# EAGLE design reg (EAGLE 9.6.2)
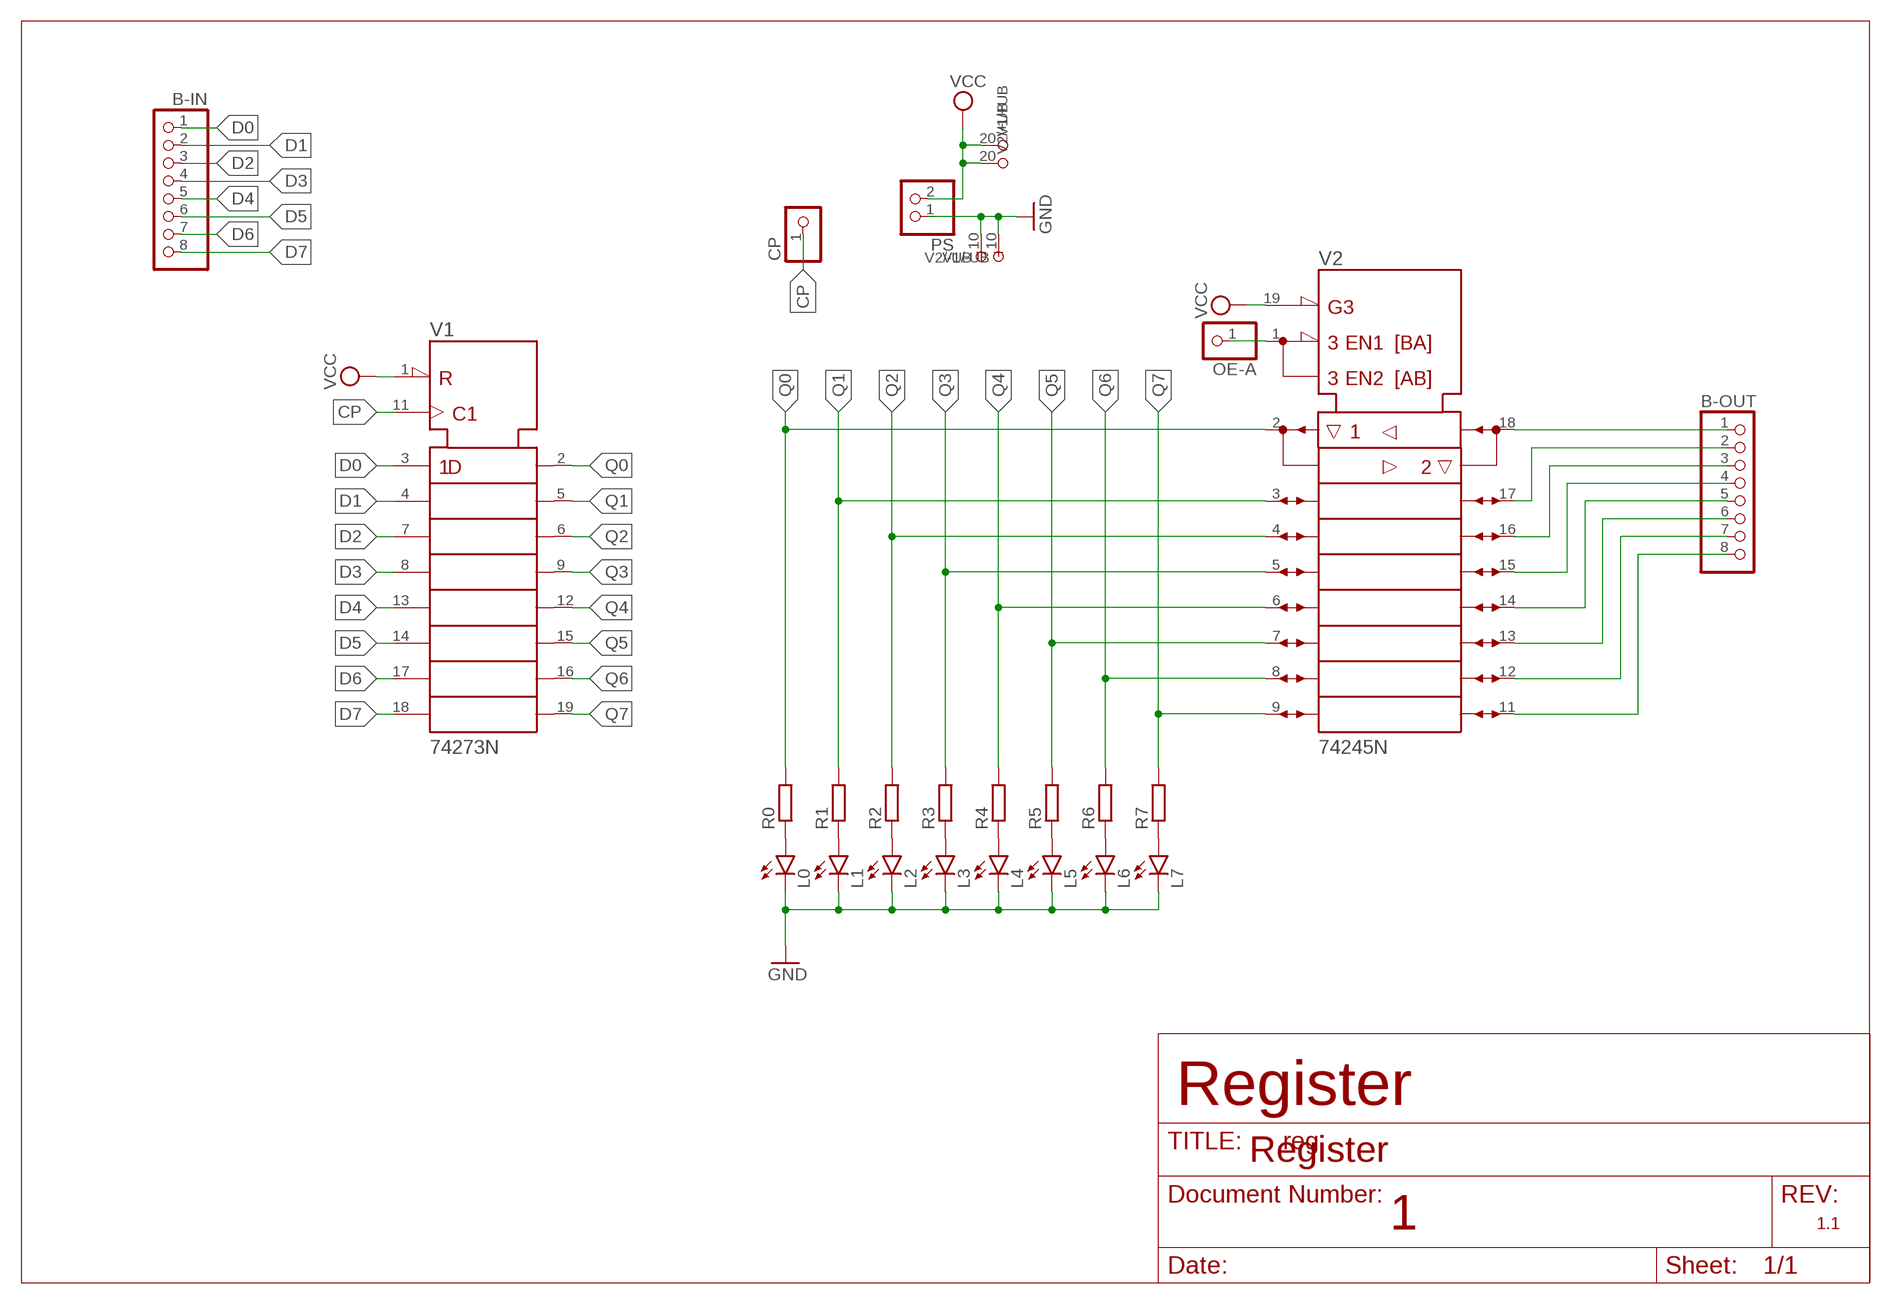
[diagram p0: schematic, sheet 1]

## Parts
B-IN  PINHD-1X8  [1X08]
B-OUT  PINHD-1X8  [1X08]
CP  PINHD-1X1  [1X01]
L0  LED5MM  [LED5MM]
L1  LED5MM  [LED5MM]
L2  LED5MM  [LED5MM]
L3  LED5MM  [LED5MM]
L4  LED5MM  [LED5MM]
L5  LED5MM  [LED5MM]
L6  LED5MM  [LED5MM]
L7  LED5MM  [LED5MM]
OE-A  PINHD-1X1  [1X01]
PS  PINHD-1X2  [1X02]
R0  R-EU_0204/7  [0204/7]
R1  R-EU_0204/7  [0204/7]
R2  R-EU_0204/7  [0204/7]
R3  R-EU_0204/7  [0204/7]
R4  R-EU_0204/7  [0204/7]
R5  R-EU_0204/7  [0204/7]
R6  R-EU_0204/7  [0204/7]
R7  R-EU_0204/7  [0204/7]
V1  74273N  [DIL20]
V2  74245N  [DIL20]

## Nets
BO0: B-OUT.8 V2.11(B8)
BO1: B-OUT.7 V2.12(B7)
BO2: B-OUT.6 V2.13(B6)
BO3: B-OUT.5 V2.14(B5)
BO4: B-OUT.4 V2.15(B4)
BO5: B-OUT.3 V2.16(B3)
BO6: B-OUT.2 V2.17(B2)
BO7: B-OUT.1 V2.18(B1)
CP: CP.1 V1.11(CLK)
D0: B-IN.1 V1.3(1D)
D1: B-IN.2 V1.4(2D)
D2: B-IN.3 V1.7(3D)
D3: B-IN.4 V1.8(4D)
D4: B-IN.5 V1.13(5D)
D5: B-IN.6 V1.14(6D)
D6: B-IN.7 V1.17(7D)
D7: B-IN.8 V1.18(8D)
GND: L0.K(C) L1.K(C) L2.K(C) L3.K(C) L4.K(C) L5.K(C) L6.K(C) L7.K(C) PS.1 V1.10(-UB) V2.10(-UB)
N$1: L7.A R7.1
N$5: L6.A R6.1
N$6: L5.A R5.1
N$7: L4.A R4.1
N$8: L3.A R3.1
N$9: L2.A R2.1
N$10: L1.A R1.1
N$11: L0.A R0.1
N$19: OE-A.1 V2.1(DIR)
Q0: R0.2 V1.2(1Q) V2.2(A1)
Q1: R1.2 V1.5(2Q) V2.3(A2)
Q2: R2.2 V1.6(3Q) V2.4(A3)
Q3: R3.2 V1.9(4Q) V2.5(A4)
Q4: R4.2 V1.12(5Q) V2.6(A5)
Q5: R5.2 V1.15(6Q) V2.7(A6)
Q6: R6.2 V1.16(7Q) V2.8(A7)
Q7: R7.2 V1.19(8Q) V2.9(A8)
VCC: PS.2 V1.1(!CLR) V1.20(+UB) V2.19(!G) V2.20(+UB)

## Notes on the sheet
- Register
- Register
- 1 | 1.1

## Library data of the parts
B-IN B-OUT = pinhead:PINHD-1X8: PIN HEADER
CP OE-A = pinhead:PINHD-1X1: PIN HEADER
L0 L1-L7 = led:LED: LED OSRAM: - CHIPLED LG R971, LG N971, LY N971, LG Q971, LY Q971, LO R971, LY R971 LH N974, LH R974 LS Q976, LO Q976, LY Q976 LO Q996 - Hyper CHIPLED LW Q18S LB Q993, LB Q99A, LB R99A - SideLED LS A670, LO A670, LY A670, LG A670, LP A670 LB A673, LV A673, LT A673, LW A673 LH A674 LY A675 LS A676, LA A676, LO A676, LY A676, LW A676 LS A679, LY A679, LG A679 - Hyper Micro SIDELED® LS Y876, LA Y876, LO Y876, LY Y876 LT Y87S - SmartLED LW L88C, LW L88S LB L89C, LB L89S, LG L890 LS L89K, LO L89K, LY L89K LS L896, LA L896, LO L896, LY L896 - TOPLED LS T670, LO T670, LY T670, LG T670, LP T670 LSG T670, LSP T670, LSY T670, LOP T670, LYG T670 LG T671, LOG T671, LSG T671 LB T673, LV T673, LT T673, LW T673 LH T674 LS T676, LA T676, LO T676, LY T676, LB T676, LH T676, LSB T676, LW T676 LB T67C, LV T67C, LT T67C, LS T67K, LO T67K, LY T67K, LW E67C LS E67B, LA E67B, LO E67B, LY E67B, LB E67C, LV E67C, LT E67C LW T67C LS T679, LY T679, LG T679 LS T770, LO T770, LY T770, LG T770, LP T770 LB T773, LV T773, LT T773, LW T773 LH T774 LS E675, LA E675, LY E675, LS T675 LS T776, LA T776, LO T776, LY T776, LB T776 LHGB T686 LT T68C, LB T68C - Hyper Mini TOPLED® LB M676 - Mini TOPLED Santana® LG M470 LS M47K, LO M47K, LY M47K Source: http://www.osram.convergy.de LUXEON: - LUMILED® LXK2-PW12-R00, LXK2-PW12-S00, LXK2-PW14-U00, LXK2-PW14-V00 LXK2-PM12-R00, LXK2-PM12-S00, LXK2-PM14-U00 LXK2-PE12-Q00, LXK2-PE12-R00, LXK2-PE12-S00, LXK2-PE14-T00, LXK2-PE14-U00 LXK2-PB12-K00, LXK2-PB12-L00, LXK2-PB12-M00, LXK2-PB14-N00, LXK2-PB14-P00, LXK2-PB14-Q00 LXK2-PR12-L00, LXK2-PR12-M00, LXK2-PR14-Q00, LXK2-PR14-R00 LXK2-PD12-Q00, LXK2-PD12-R00, LXK2-PD12-S00 LXK2-PH12-R00, LXK2-PH12-S00 LXK2-PL12-P00, LXK2-PL12-Q00, LXK2-PL12-R00 Source: www.luxeon.com KINGBRIGHT: KA-3528ASYC Source: www.kingbright.com
PS = pinhead:PINHD-1X2: PIN HEADER
R0 R1-R7 = rcl:R-EU_: RESISTOR, European symbol; SPICEPREFIX: R
V1 = 74ttl-din:74*273: Octal D type FLIP FLOP, clear
V2 = 74ttl-din:74*245: Octal BUS TRANSCEIVER, 3-state

## Board
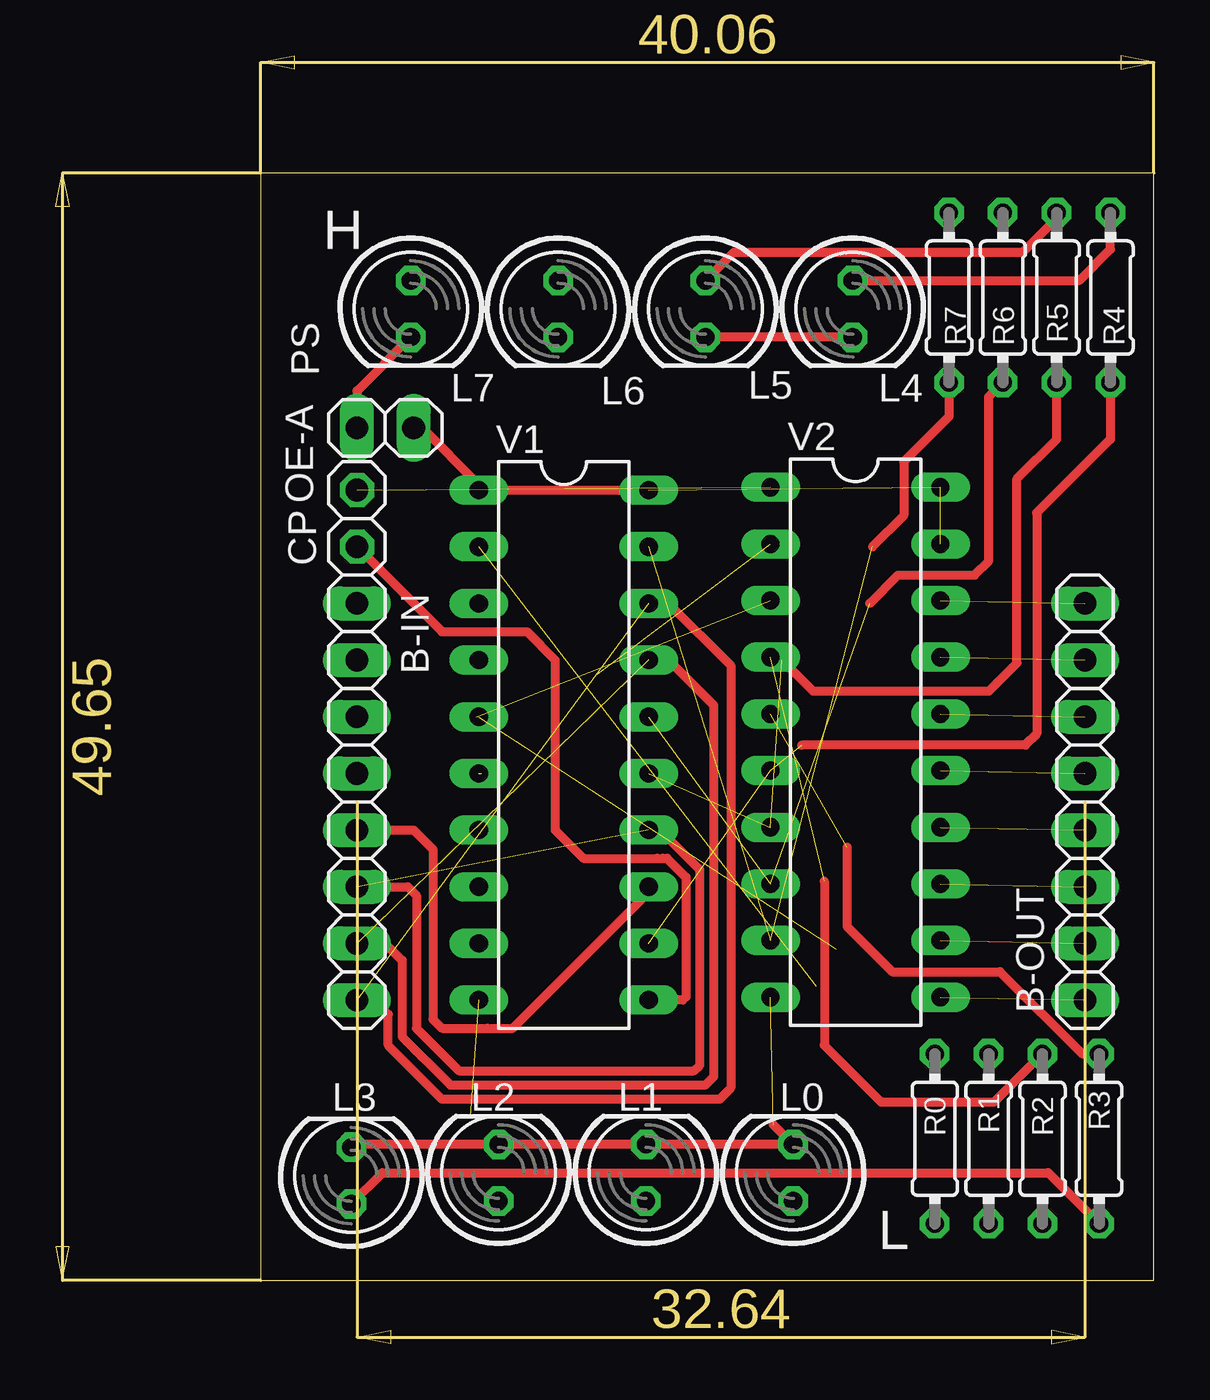
[diagram p1: board, top side]
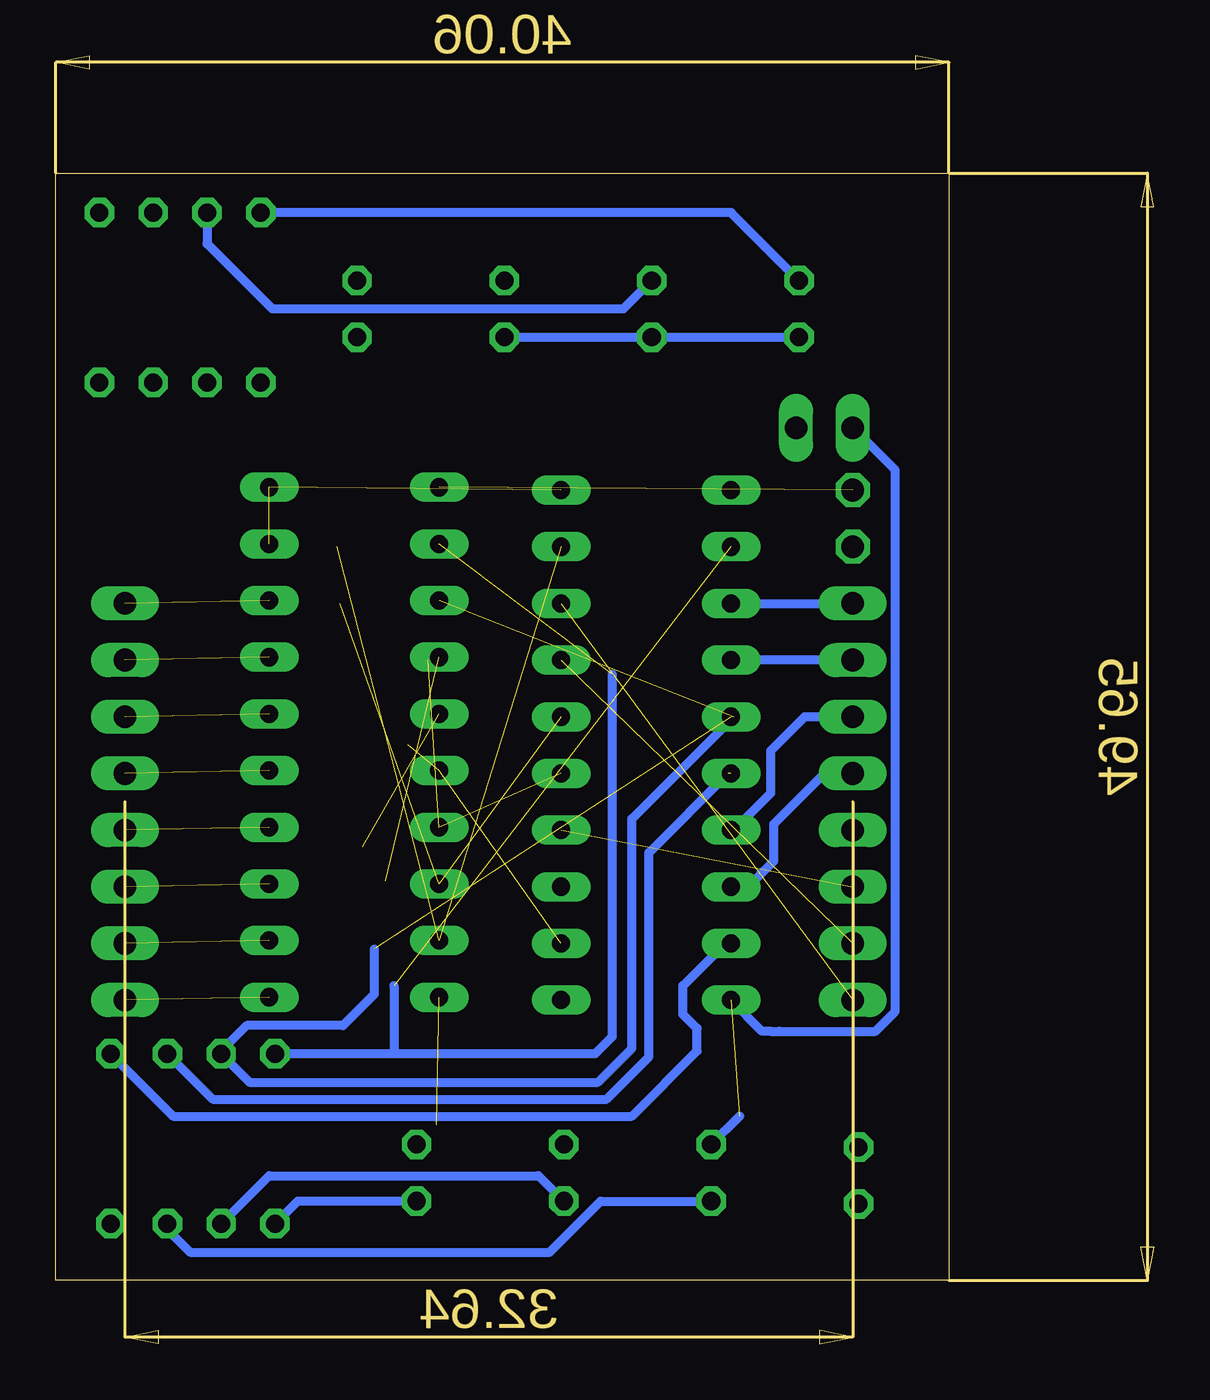
[diagram p2: board, bottom side, seen from below]

Size 40.06 x 49.65 mm. Coordinates in mm from the lower left corner, seen from the top.
Outline: 0,0 40.06,0 40.06,49.65 0,49.65 0,0
Copper layers (1*16): Top 0.035mm / dielectric 1.5mm / Bottom 0.035mm
Design rules "default": minimum track width 6mil, minimum drill 0.35mm, track to track 6mil, track to pad 6mil, pad to pad 6mil, via to via 6mil, smd to smd 6mil, copper to edge 40mil, drill to drill 6mil, minimum pad ring 10mil, minimum via ring 8mil, stop-mask expansion 4mil, vias tented up to drill 0mil, thermal gap 10mil

### Footprints (pad centres in the part's own frame; a part is rotated, then mirrored left to right if it is on the bottom)
1X08 = drill 1.016 long: 1 -8.89,0; 2 -6.35,0; 3 -3.81,0; 4 -1.27,0; 5 1.27,0; 6 3.81,0; 7 6.35,0; 8 8.89,0
1X01 = drill 1.016 octagon: 1 0,0
LED5MM = drill 0.813 octagon: A -1.27,0; K 1.27,0
1X02 = drill 1.016 long: 1 -1.27,0; 2 1.27,0
0204/7 = drill 0.813 octagon: 1 -3.81,0; 2 3.81,0
DIL20 = drill 0.813 long: 1 -11.43,-3.81; 2 -8.89,-3.81; 3 -6.35,-3.81; 4 -3.81,-3.81; 5 -1.27,-3.81; 6 1.27,-3.81; 7 3.81,-3.81; 8 6.35,-3.81; 9 8.89,-3.81; 10 11.43,-3.81; 11 11.43,3.81; 12 8.89,3.81; 13 6.35,3.81; 14 3.81,3.81; 15 1.27,3.81; 16 -1.27,3.81; 17 -3.81,3.81; 18 -6.35,3.81; 19 -8.89,3.81; 20 -11.43,3.81

### Placement (x,y rotation side)
B-IN  4.32,21.46 270 top
B-OUT  36.96,21.46 270 top
CP  4.32,32.89 0 top
L0  23.88,4.83 90 top
L1  17.27,4.83 90 top
L2  10.67,4.83 90 top
L3  4.06,4.7 90 top
L4  26.54,43.56 270 top
L5  19.94,43.56 270 top
L6  13.34,43.56 270 top
L7  6.73,43.56 270 top
OE-A  4.32,35.43 0 top
PS  5.59,38.23 0 top
R0  30.23,6.35 90 top
R1  32.64,6.35 90 top
R2  35.05,6.35 90 top
R3  37.59,6.35 90 top
R4  38.1,44.07 270 top
R5  35.69,44.07 270 top
R6  33.27,44.07 270 top
R7  30.86,44.07 270 top
V1  13.59,24 270 top
V2  26.67,24.13 270 top

### Tracks (layer width: path | path; a pad name or v marks a point on that pad's centre or on a via)
BO0  (1 unrouted)
BO1  (1 unrouted)
BO2  (1 unrouted)
BO3  (1 unrouted)
BO4  (1 unrouted)
BO5  (1 unrouted)
BO6  (1 unrouted)
BO7  (1 unrouted)
CP
  Top 0.4: CP.1 8.13,29.08 11.94,29.08 13.21,27.81 13.21,20.19 14.48,18.92 17.78,18.92 18.03,18.92 18.22,18.92 19.07,18.07 19.07,12.72 18.92,12.57 V1.11
D0
  Bottom 0.4: V1.3 B-IN.1
D1
  Bottom 0.4: B-IN.2 V1.4
D2
  Bottom 0.4: B-IN.3 6.48,25.27 8,23.75 8,21.84 9.65,20.19 V1.7
D3
  Bottom 0.4: B-IN.4 5.59,22.73 7.87,20.45 7.87,18.8 9.02,17.65 V1.8
D4
  Top 0.4: B-IN.5 6.86,20.19 7.72,19.33 7.72,11.71 8.13,11.3 10.16,11.3 10.67,11.3 11.3,11.3 17.4,17.4 V1.13
D5  (1 unrouted)
  Top 0.4: 17.91,20.19 19.68,18.41 19.68,9.65 19.43,9.4 8.89,9.4 6.99,11.3 6.99,17.27 6.6,17.65 B-IN.6
D6  (1 unrouted)
  Top 0.4: 18.29,27.81 20.32,25.78 20.32,9.14 19.94,8.76 8.51,8.76 6.35,10.92 6.35,14.35 5.59,15.11 B-IN.7
D7  (1 unrouted)
  Top 0.4: 18.29,30.35 21.08,27.56 21.08,8.64 20.57,8.13 8.13,8.13 5.71,10.54 5.71,11.94 5.08,12.57 B-IN.8
GND  (2 unrouted)
  Top 0.4: 22.99,6.99 L0.K L1.K L2.K 4.19,6.1 L3.K | L4.K L5.K | L7.K 4.32,39.88 PS.1
  Bottom 0.4: PS.1 2.41,36.32 2.41,12.06 3.3,11.18 7.62,11.18 8,11.18 8.38,11.18 V1.10 | 9.4,7.37 L2.K | L5.K L6.K L7.K
N$1
  Bottom 0.4: L7.A 9.78,47.88 R7.1
N$5
  Bottom 0.4: R6.1 33.27,46.48 30.35,43.56 14.61,43.56 L6.A
N$6
  Top 0.4: L5.A 21.21,46.1 34.16,46.1 35.69,47.62 R5.1
N$7
  Top 0.4: L4.A 36.7,44.83 38.1,46.23 R4.1
N$8
  Top 0.4: L3.A 5.46,4.83 35.31,4.83 R3.1
N$9
  Bottom 0.4: R2.1 35.05,2.29 34.04,1.27 17.91,1.27 15.62,3.56 L2.A
N$10
  Bottom 0.4: R1.1 30.48,4.7 18.41,4.7 L1.A
N$11
  Bottom 0.4: L0.A 29.21,3.56 R0.1
N$19  (1 unrouted)
Q0  (2 unrouted)
  Bottom 0.4: 15.11,27.18 15.11,10.92 15.88,10.16 25.02,10.16 | 25.02,10.16 R0.2 | 25.02,10.16 24.89,10.29 24.89,13.21
Q1  (2 unrouted)
  Bottom 0.4: 9.65,25.27 14.22,20.7 14.22,10.41 15.75,8.89 31.37,8.89 R1.2 32.64,10.29 31.5,11.43 27.18,11.43 25.78,12.83 25.78,14.86
Q2  (2 unrouted)
  Top 0.4: 25.27,17.91 25.27,10.54 27.81,8 32.89,8 R2.2
  Bottom 0.4: R2.2 33.02,8.13 15.37,8.13 13.46,10.03 13.46,19.18 9.91,22.73
Q3  (1 unrouted)
  Top 0.4: R3.2 36.83,10.16 33.15,13.84 28.32,13.84 26.29,15.88 26.29,19.43
  Bottom 0.4: R3.2 34.8,7.37 14.22,7.37 11.3,10.29 11.3,11.3 11.94,11.94 11.94,13.21 10.03,15.11 V1.9
Q4  (2 unrouted)
  Top 0.4: R4.2 38.1,37.72 34.8,34.42 34.8,24.51 34.29,24 24.26,24
Q5  (2 unrouted)
  Top 0.4: R5.2 35.69,37.72 33.91,35.94 33.91,27.69 32.64,26.42 24.77,26.42 23.37,27.81
Q6  (2 unrouted)
  Top 0.4: R6.2 32.64,39.62 32.64,32.26 32,31.62 28.57,31.62 27.3,30.35
Q7  (2 unrouted)
  Top 0.4: R7.2 30.86,38.73 28.83,36.7 28.83,34.29 27.43,32.89
VCC  (2 unrouted)
  Top 0.4: PS.2 7.24,38.23 9.78,35.69 V1.1 V1.20

### Text on the board
tPlace: H | L